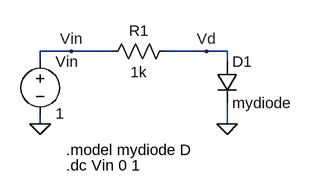
[diagram p0: schematic Fig1_17.asc]
Fig1_17.asc, the LTspice schematic file:
Version 4
SHEET 1 1048 680
WIRE 48 224 0 224
WIRE 112 224 48 224
WIRE 256 224 192 224
WIRE 288 224 256 224
WIRE 0 240 0 224
WIRE 288 240 288 224
WIRE 0 336 0 320
WIRE 288 336 288 304
FLAG 0 336 0
FLAG 288 336 0
FLAG 256 224 Vd
FLAG 48 224 Vin
SYMBOL voltage 0 224 R0
WINDOW 123 0 0 Left 0
WINDOW 39 0 0 Left 0
SYMATTR InstName Vin
SYMATTR Value 1
SYMBOL res 96 240 R270
WINDOW 0 32 56 VTop 0
WINDOW 3 0 56 VBottom 0
SYMATTR InstName R1
SYMATTR Value 1k
SYMBOL diode 272 240 R0
SYMATTR InstName D1
SYMATTR Value mydiode
TEXT 40 400 Left 0 !.dc Vin 0 1 
TEXT 40 376 Left 0 !.model mydiode D

The netlist it stands for:
* Fig1_17.asc
Vin Vin 0 1
R1 Vin Vd 1k
D1 Vd 0 mydiode
.model D D
.lib standard.dio
.dc Vin 0 1
.model mydiode D
.backanno
.end